# Altium schematic sheet OMD_Mag_Encoder.SchDoc
size A4; Organization: Altium Limited; Address1: L3, 12a Rodborough Rd; Address2: Frenchs Forest; Address3: NSW; Address4: Australia 2086
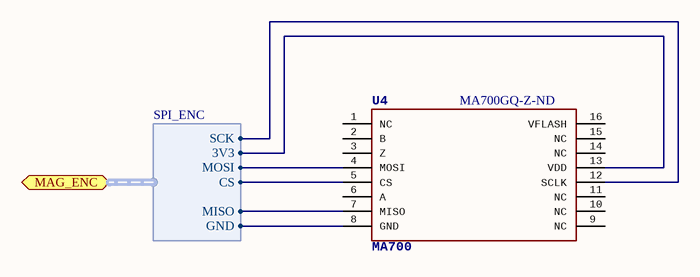
[diagram p0: OMD_Mag_Encoder.SchDoc]

## Parts
U4  MA700  Supplier Part Number 1: MA700GQ-Z-ND  [QFN16]

## Ports
MAG_ENC (harness SPI_ENC)

## Harnesses
SPI_ENC: SCK, MISO, MOSI, CS, 3V3, GND

## Nets
NetU4_4: U4.4(MOSI) ; port MAG_ENC.MOSI
NetU4_5: U4.5(CS) ; port MAG_ENC.CS
NetU4_7: U4.7(MISO) ; port MAG_ENC.MISO
NetU4_8: U4.8(GND) ; port MAG_ENC.GND
NetU4_12: U4.12(SCLK) ; port MAG_ENC.SCK
NetU4_13: U4.13(VDD) ; port MAG_ENC.3V3

Not connected (* = marked no-connect by the designer): U4 1(NC) 2(B) 3(Z) 6(A) 9(NC) 10(NC) 11(NC) 14(NC) 15(NC) 16(VFLASH)

## Notes on the sheet
- https://github.com/OpenMotorDrive
- https://creativecommons.org/licenses/by-nc-sa/4.0/
- For Commercial use, please contact ProfiCNC
- Title
- Size:
- Date:
- A4
- Number:
- Time:
- Revision:
- Sheet
- of
- ProfiCNC Pty. Ltd.
- ProfiCNC does NOT guaranty these drawings as fit for any purpose, you must verify this information before attempting to use it in any way.  USE AT OWN RISK
- File:

## Library data of the parts
U4 = MA700: Supplier 1: Digi-Key